# Altium project PCB_Project.PrjPcb
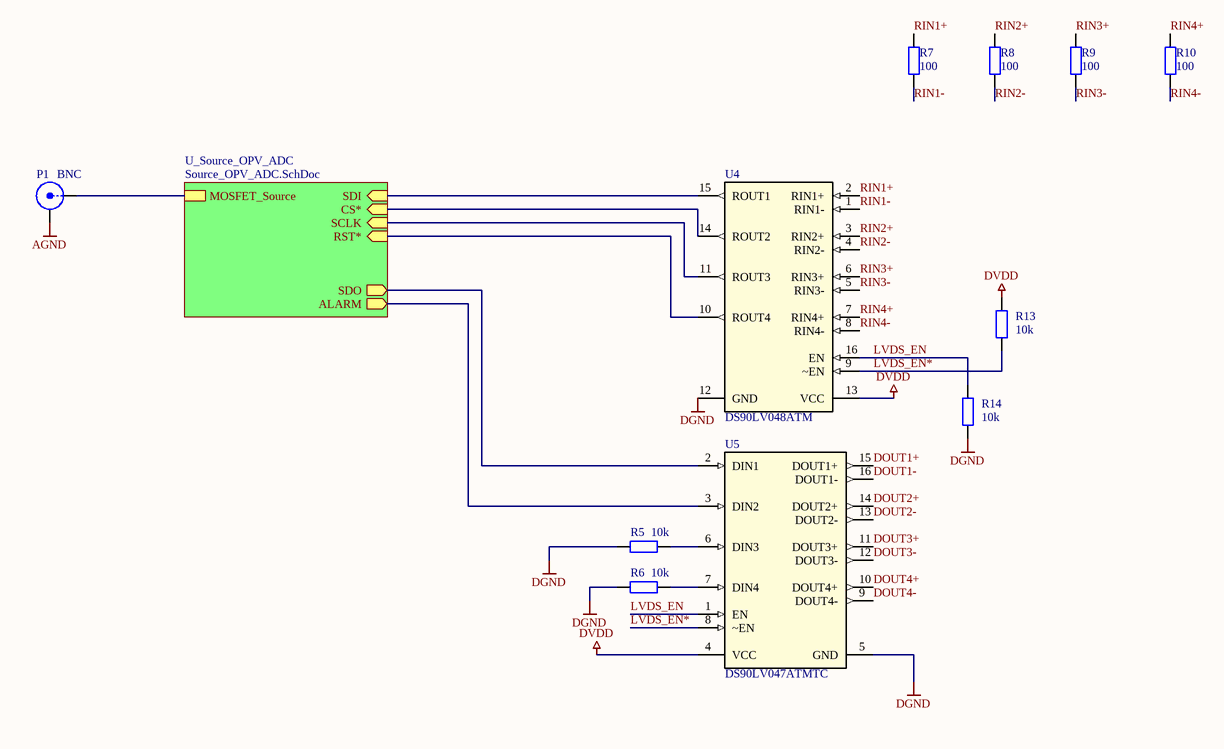
[diagram p0: TOP_Sheet.SchDoc]
3 sheets, 28 parts. Net scope: hierarchical (ports join the sheet entries above them; power ports are global).
Board file: PCB1.PcbDoc
Sheets:
  TOP_Sheet.SchDoc
    U_Source_OPV_ADC = Source_OPV_ADC.SchDoc
  SPI_Diff_Slave.SchDoc

## Sheet TOP_Sheet.SchDoc
size A4; Organization: HTL Hollabrunn; Address1: Abteilung Elektronik; Address2: Anton Ehrenfried-Straße 10; Address3: 2020 Hollabrunn

### Parts
P1  BNC  [BNC_RA CON]
R5  10k  [C1206-KUE]
R6  10k  [C1206-KUE]
R7  100  [C1206-KUE]
R8  100  [C1206-KUE]
R9  100  [C1206-KUE]
R10  100  [C1206-KUE]
R13  10k  [C1206-KUE]
R14  10k  [C1206-KUE]
U4  DS90LV048ATM  [SOIC-16N]
U5  DS90LV047ATMTC  [SOIC-16N]

### Sub-sheets
U_Source_OPV_ADC = Source_OPV_ADC.SchDoc: MOSFET_Source, SDI (in), CS* (in), SCLK (in), SDO (out), ALARM (out), RST* (in)

### Nets
AGND: P1.2(Y)
DGND: R5.2 R6.2 R14.1 U4.12(GND) U5.5(GND)
DVDD: R13.2 U4.13(VCC) U5.4(VCC)
DOUT1+: U5.15(DOUT1+)
DOUT1-: U5.16(DOUT1-)
DOUT2+: U5.14(DOUT2+)
DOUT2-: U5.13(DOUT2-)
DOUT3+: U5.11(DOUT3+)
DOUT3-: U5.12(DOUT3-)
DOUT4+: U5.10(DOUT4+)
DOUT4-: U5.9(DOUT4-)
LVDS_EN: R14.2 U4.16(EN) U5.1(EN)
LVDS_EN*: R13.1 U4.9(~EN) U5.8(~EN)
RIN1+: R7.1 U4.2(RIN1+)
RIN1-: R7.2 U4.1(RIN1-)
RIN2+: R8.1 U4.3(RIN2+)
RIN2-: R8.2 U4.4(RIN2-)
RIN3+: R9.1 U4.6(RIN3+)
RIN3-: R9.2 U4.5(RIN3-)
RIN4+: R10.1 U4.7(RIN4+)
RIN4-: R10.2 U4.8(RIN4-)
NetC1_1: P1.1(X) ; sheet U_Source_OPV_ADC/MOSFET_Source
NetR5_1: R5.1 U5.6(DIN3)
NetR6_1: R6.1 U5.7(DIN4)
NetR12_1: U4.10(ROUT4) ; sheet U_Source_OPV_ADC/RST*
NetU1_10: U4.15(ROUT1) ; sheet U_Source_OPV_ADC/SDI
NetU1_11: U4.14(ROUT2) ; sheet U_Source_OPV_ADC/CS*
NetU1_12: U4.11(ROUT3) ; sheet U_Source_OPV_ADC/SCLK
NetU1_13: U5.2(DIN1) ; sheet U_Source_OPV_ADC/SDO
NetU1_14: U5.3(DIN2) ; sheet U_Source_OPV_ADC/ALARM

### Notes on the sheet
- Title
- Size:
- Date:
- A4
- Number:
- Time:
- Revision:
- Sheet
- of
- HTL Hollabrunn
- Abteilung Elektronik
- Anton Ehrenfried-Straße 10
- 2020 Hollabrunn
- File:
- Drawn By:

### Library data of the parts
P1 = BNC: BNC Elbow Connector; LatestRevisionDate: 17-Jul-2002; LatestRevisionNote: Re-released for DXP Platform.; Publisher: Altium Limited
R5-R10 R13 R14 = ResistorSMD: Resistor SMD; Manufacturer: AVX; Bezeichnung: SMD Wid. 1/8W 2%; Published: 8-Jun-2000; LatestRevisionDate: 17-Jul-2002; LatestRevisionNote: Re-released for DXP Platform.; PackageReference: AXIAL-0.4; Publisher: Altium Limited; PackageDescription: Axial Device, Thru-Hole; 2 Leads; 0.4 in Pin Spacing; Orderingcode: *
  R5 R6 R13 R14: Value: 10k
  R7-R10: Value: 100
U4 = DS90LV048ATM: 400-Mbps LVDS quad high-speed differential receiver 16-SOIC -40 to 85; Manufacturer_Name: Texas Instruments; Manufacturer: NationalSemiconductor; PackageTopMarking: NS2ZXYTTE#DS90LV048ATM; PowerWise: N; CompType: InterfaceIC; ComponentLink1DescBC: DS90LV048ADatasheet; ComponentLink2DescA4: DS90LV048AWebPage; ComponentLink3DescAC: M16APackagePage; Copyright: Copyright (C) 2026 Ultra Librarian. All rights reserved.; Manufacturer_Part_Number: DS90LV048ATM; Datasheet: https://www.ti.com/lit/gpn/ds90lv048a; Published: 4-Dec-2008; DatasheetVersion: May-2001; PackageVersion: revJAug-1995; PackageReference: M16A; Publisher: AltiumLimited; PackageDescription: MoldedPackageSO150inWide16Lead; Supplier: 1Farnell; SUPPLIER_2: PartNumb0C9485856; PartNumber: DS90LV048ATM; RoHS: N; PinCount: 16; Code_JEDEC: MS-012-AC; Code_IPC: SOIC127P600-16; ComponentLink1URL: http//wwwnationalcom/ds/DS/DS90LV048Apdf; ComponentLink2URL: http//wwwnationalcom/pf/DS/DS90LV048Ahtml; ComponentLink3URL: http//wwwnationalcom/packaging/folders/m16ahtml
U5 = DS90LV047ATMTC: 400-Mbps LVDS quad high-speed differential driver 16-TSSOP -40 to 85; Manufacturer_Name: Texas Instruments; Manufacturer: NationalSemiconductor; PackageTopMarking: NS2ZXYTTDS90LV047AT; PowerWise: N; CompType: InterfaceIC; ComponentLink1DescBC: DS90LV047ADatasheet; ComponentLink2DescA4: DS90LV047AWebPage; ComponentLink3DescAC: MTC16PackagePage; Copyright: Copyright (C) 2025 Ultra Librarian. All rights reserved.; Manufacturer_Part_Number: DS90LV047ATMTC; Published: 4-Dec-2008; DatasheetVersion: Jan-2003; PackageVersion: revDJun-2003; PackageReference: MTC16; Publisher: AltiumLimited; PackageDescription: MoldedTSSOPJedec5x44x09mmBody16Lead065mmPitch; Supplier: 1Farnell; SUPPLIER_2: PartNumb0C9778659; PartNumber: DS90LV047ATMTC; RoHS: N; PinCount: 16; Code_JEDEC: MO-153-AB; ComponentLink1URL: http//wwwnationalcom/ds/DS/DS90LV047Apdf; ComponentLink2URL: http//wwwnationalcom/pf/DS/DS90LV047Ahtml; ComponentLink3URL: http//wwwnationalcom/packaging/folders/mtc16html

## Sheet Source_OPV_ADC.SchDoc
size A4; Organization: HTL Hollabrunn; Address1: Abteilung Elektronik; Address2: Anton Ehrenfried-Straße 10; Address3: 2020 Hollabrunn; SheetNumber: 1; SheetTotal: 1; SPICEModelCacheMUVHOLEX: <root> / <DocumentId>MUVHOLEX</DocumentId> / <CacheFrame Number="0"> / <Model Name="ua741" Kind="CKT"> / <Text>*==================================================== / *uA741 / *Sngl GenPurpose OpAmp pkg:DIP8 3,2,7,4,6. pkg:CAN8 3,2,7,4,6. / * Connections: / *             Non-Inverting Input / *             | Inverting Input / *             | | Positive Power Supply / *             | | | Negative Power Supply / *             | | | | Output / *             | | | | | / .SUBCKT UA741 1 2 3 4 5 / C1   11 12 4.664E-12 / C2    6  7 20E-12 / DC    5 53 DX / DE   54  5 DX / DLP  90 91 DX / DLN  92 90 DX / DP    4  3 DX / BGND 99  0 V=V(3)*.5 + V(4)*.5 / BB    7 99 I=I(VB)*10.61E6 - I(VC)*10E6 + I(VE)*10E6 + / +              I(VLP)*10E6 - I(VLN)*10E6 / GA    6  0 11 12 137.7E-6 / GCM   0  6 10 99 2.574E-9 / IEE  10  4 DC 10.16E-6 / HLIM 90  0 VLIM 1K / Q1   11  2 13 QX / Q2   12  1 14 QX / R2    6  9 100E3 / RC1   3 11 7.957E3 / RC2   3 12 7.957E3 / RE1  13 10 2.74E3 / RE2  14 10 2.74E3 / REE  10 99 19.69E6 / RO1   8  5 150 / RO2   7 99 150 / RP    3  4 18.11E3 / VB    9  0 DC 0 / VC    3 53 DC 2.6 / VE   54  4 DC 2.6 / VLIM  7  8 DC 0 / VLP  91  0 DC 25 / VLN   0 92 DC 25 / .MODEL DX D(IS=800E-18) / .MODEL QX NPN(IS=800E-18 BF=62.5) / .ENDS UA741</Text> / </Model> / <Model Name="cap" Kind="MDL"> / <Text>*Default semiconductor capacitor / .MODEL CAP C()</Text> / </Model> / </CacheFrame> / </root>
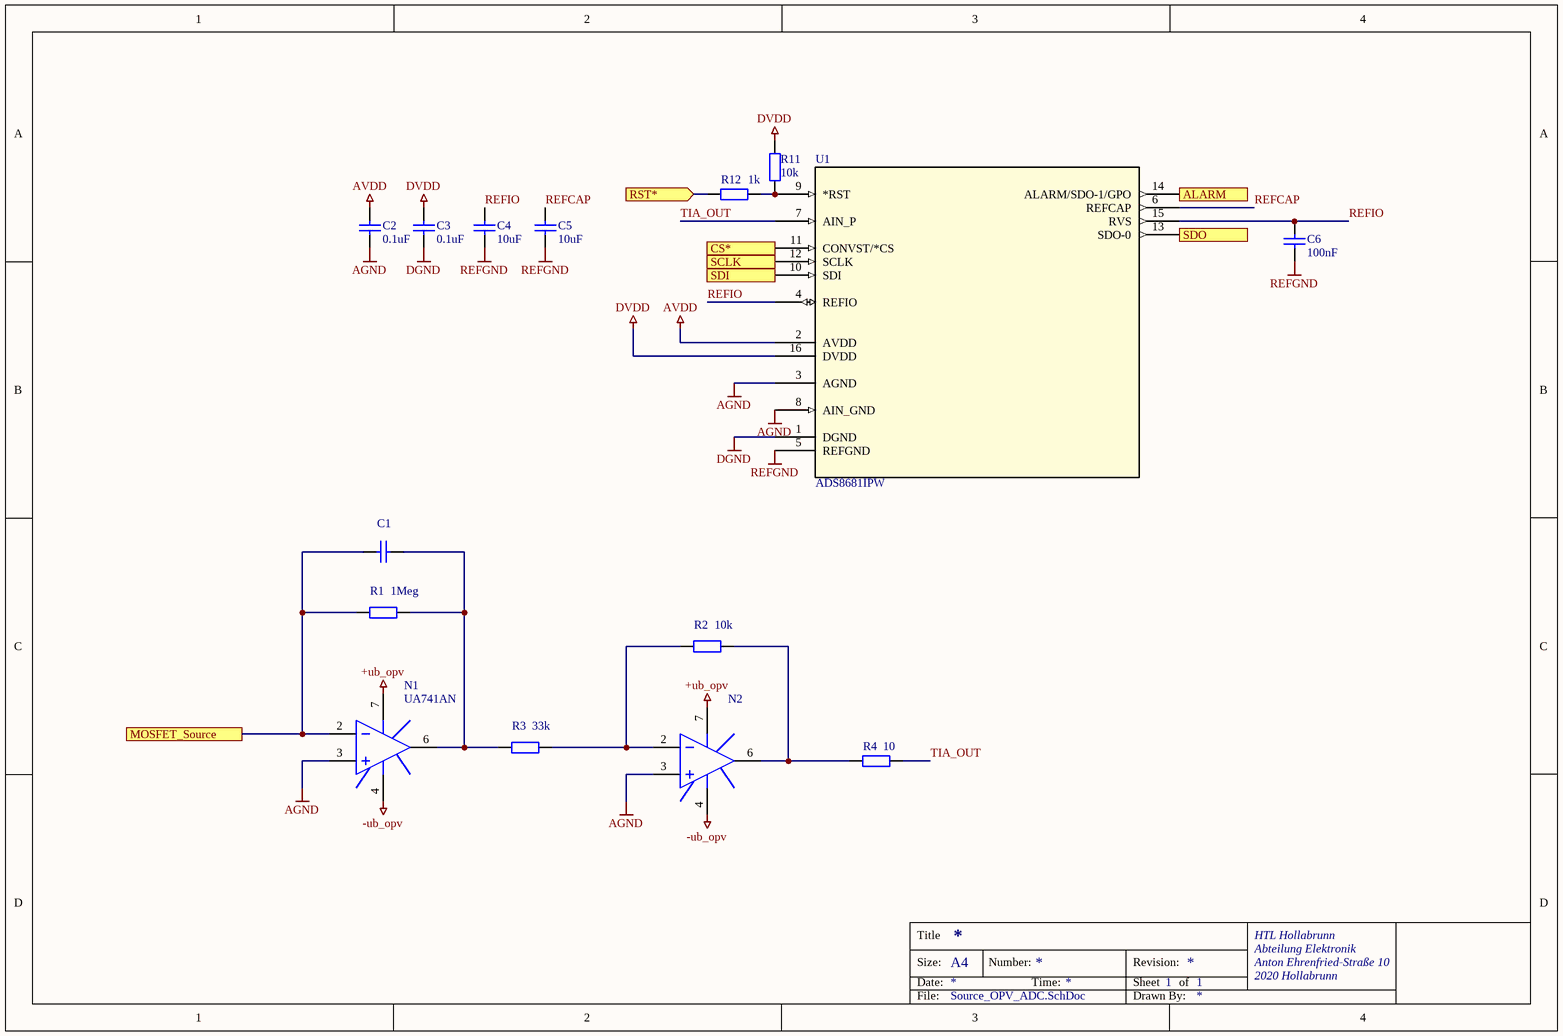
[diagram p1: Source_OPV_ADC.SchDoc]

### Parts
C1  100nF  [C1206-KUE]  (value not drawn)
C2  0.1uF  [C1206-KUE]
C3  0.1uF  [C1206-KUE]
C4  10uF  [C1206-KUE]
C5  10uF  [C1206-KUE]
C6  100nF  [C1206-KUE]
N1  UA741AN  [DIP8]
N2  UA741AN  [DIP8]  (value not drawn)
R1  1Meg  [C1206-KUE]
R2  10k  [C1206-KUE]
R3  33k  [C1206-KUE]
R4  10  [C1206-KUE]
R11  10k  [C1206-KUE]
R12  1k  [C1206-KUE]
U1  ADS8681IPW  [PW16_TEX]

### Ports
ALARM (out), CS* (in), MOSFET_Source, RST* (in), SCLK (in), SDI (in), SDO (out)

### Nets
+ub_opv: N1.7(V+) N2.7(V+)
-ub_opv: N1.4(V-) N2.4(V-)
AGND: C2.1 N1.3(IN+) N2.3(IN+) U1.3(AGND) U1.8(AIN_GND)
AVDD: C2.2 U1.2(AVDD)
DGND: C3.1 U1.1(DGND)
DVDD: C3.2 R11.1 U1.16(DVDD)
REFGND: C4.1 C5.1 C6.1 U1.5(REFGND)
REFCAP: C5.2 U1.6(REFCAP)
REFIO: C4.2 C6.2 U1.4(REFIO) U1.15(RVS)
TIA_OUT: R4.1 U1.7(AIN_P)
NetC1_1: C1.1 N1.2(IN-) R1.2 ; port MOSFET_Source
NetC1_2: C1.2 N1.6(OUT) R1.1 R3.2
NetN2_2: N2.2(IN-) R2.2 R3.1
NetN2_6: N2.6(OUT) R2.1 R4.2
NetR11_2: R11.2 R12.2 U1.9(*RST)
NetR12_1: R12.1 ; port RST*
NetU1_10: U1.10(SDI) ; port SDI
NetU1_11: U1.11(CONVST/*CS) ; port CS*
NetU1_12: U1.12(SCLK) ; port SCLK
NetU1_13: U1.13(SDO-0) ; port SDO
NetU1_14: U1.14(ALARM/SDO-1/GPO) ; port ALARM

Not connected (* = marked no-connect by the designer): N1 1(OS_NULL) 5(OS_NULL) 8(NC); N2 1(OS_NULL) 5(OS_NULL) 8(NC)

### Notes on the sheet
- Title
- Size:
- Date:
- A4
- Number:
- Time:
- Revision:
- Sheet
- of
- HTL Hollabrunn
- Abteilung Elektronik
- Anton Ehrenfried-Straße 10
- 2020 Hollabrunn
- File:
- Drawn By:

### Library data of the parts
C1-C6 = Capacitor: Manufacturer: Kemet; Bezeichnung: Kerko +-10% 63V; Published: 8-Jun-2000; LatestRevisionDate: 17-Jul-2002; LatestRevisionNote: Re-released for DXP Platform.; PackageReference: RAD-0.3; Publisher: Altium Limited; PackageDescription: Radial Cap, Thru-Hole; 2 Leads; 0.3 in Pin Spacing; Orderingcode: *
  C1 C6: Value: 100nF
  C2 C3: Value: 0.1uF
  C4 C5: Value: 10uF
N1 N2 = UA741AN: General-Purpose Single Operational Amplifier; Published: 24-Aug-2001; LatestRevisionDate: 06-Jun-2005; LatestRevisionNote: Stylized 3D Model Added.; DatasheetVersion: Oct-1997; PackageReference: DIP8; Publisher: Altium Limited; PackageDescription: DIP; 8 Leads; Row Spacing 7.62 mm; Pitch 2.54 mm; Code_JEDEC: MO-001-AN; ComponentLink1Description: Manufacturer Link; ComponentLink1URL: http://www.st.com/; ComponentLink2Description: Datasheet; ComponentLink2URL: http://www.st.com/stonline/products/literature/ds/5304/ua741.pdf
R1-R4 R11 R12 = ResistorSMD: as R5 on sheet TOP_Sheet; Published: 8-Jun-2000; LatestRevisionDate: 17-Jul-2002; LatestRevisionNote: Re-released for DXP Platform.; PackageReference: AXIAL-0.4; Publisher: Altium Limited; PackageDescription: Axial Device, Thru-Hole; 2 Leads; 0.4 in Pin Spacing; Orderingcode: *
  R1: Value: 1Meg
  R2 R11: Value: 10k
  R3: Value: 33k
  R4: Value: 10
  R12: Value: 1k
U1 = ADS8681IPW: 16-bit, 1MSPS 1-ch SAR ADC with programmable (Â±12V, Â±10V, Â±6V, Â±5V, Â±2.5V) input ranges on 5V supply 16-TSSOP -40 to 125; Manufacturer_Name: Texas Instruments; Copyright: Copyright (C) 2025 Ultra Librarian. All rights reserved.; Manufacturer_Part_Number: ADS8681IPW; RefDes: RefDes; Type: Type

## Sheet SPI_Diff_Slave.SchDoc
size A4; Organization: HTL Hollabrunn; Address1: Abteilung Elektronik; Address2: Anton Ehrenfried-Straße 10; Address3: 2020 Hollabrunn
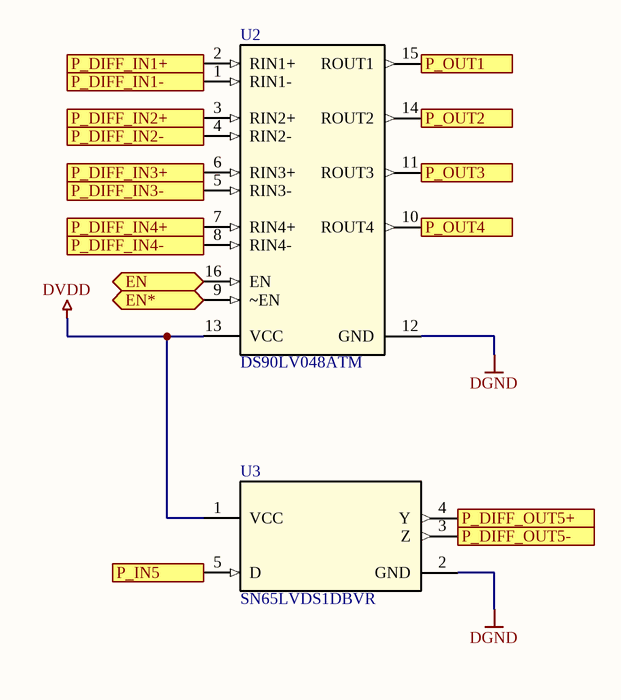
[diagram p2: SPI_Diff_Slave.SchDoc]

### Parts
U2  DS90LV048ATM  [SOIC-16N]
U3  SN65LVDS1DBVR  [DBV5]

### Ports
EN (bidir), EN* (bidir), P_DIFF_IN1+ (in), P_DIFF_IN1- (in), P_DIFF_IN2+ (in), P_DIFF_IN2- (in), P_DIFF_IN3+ (in), P_DIFF_IN3- (in), P_DIFF_IN4+ (in), P_DIFF_IN4- (in), P_DIFF_OUT5+ (out), P_DIFF_OUT5- (out), P_IN5 (in), P_OUT1 (out), P_OUT2 (out), P_OUT3 (out), P_OUT4 (out)

### Nets
DGND: U2.12(GND) U3.2(GND)
DVDD: U2.13(VCC) U3.1(VCC)
NetU2_1: U2.1(RIN1-) ; port P_DIFF_IN1-
NetU2_2: U2.2(RIN1+) ; port P_DIFF_IN1+
NetU2_3: U2.3(RIN2+) ; port P_DIFF_IN2+
NetU2_4: U2.4(RIN2-) ; port P_DIFF_IN2-
NetU2_5: U2.5(RIN3-) ; port P_DIFF_IN3-
NetU2_6: U2.6(RIN3+) ; port P_DIFF_IN3+
NetU2_7: U2.7(RIN4+) ; port P_DIFF_IN4+
NetU2_8: U2.8(RIN4-) ; port P_DIFF_IN4-
NetU2_9: U2.9(~EN) ; port EN*
NetU2_10: U2.10(ROUT4) ; port P_OUT4
NetU2_11: U2.11(ROUT3) ; port P_OUT3
NetU2_14: U2.14(ROUT2) ; port P_OUT2
NetU2_15: U2.15(ROUT1) ; port P_OUT1
NetU2_16: U2.16(EN) ; port EN
NetU3_3: U3.3(Z) ; port P_DIFF_OUT5-
NetU3_4: U3.4(Y) ; port P_DIFF_OUT5+
NetU3_5: U3.5(D) ; port P_IN5

### Notes on the sheet
- Title
- Size:
- Date:
- A4
- Number:
- Time:
- Revision:
- Sheet
- of
- HTL Hollabrunn
- Abteilung Elektronik
- Anton Ehrenfried-Straße 10
- 2020 Hollabrunn
- File:
- Drawn By:

### Library data of the parts
U2 = DS90LV048ATM: as U4 on sheet TOP_Sheet; Copyright: Copyright (C) 2026 Ultra Librarian. All rights reserved.; Manufacturer_Part_Number: DS90LV048ATM; Datasheet: https://www.ti.com/lit/gpn/ds90lv048a; Published: 4-Dec-2008; DatasheetVersion: May-2001; PackageVersion: revJAug-1995; PackageReference: M16A; Publisher: AltiumLimited; PackageDescription: MoldedPackageSO150inWide16Lead; Supplier: 1Farnell; SUPPLIER_2: PartNumb0C9485856; PartNumber: DS90LV048ATM; RoHS: N; PinCount: 16; Code_JEDEC: MS-012-AC; Code_IPC: SOIC127P600-16; ComponentLink1URL: http//wwwnationalcom/ds/DS/DS90LV048Apdf; ComponentLink2URL: http//wwwnationalcom/pf/DS/DS90LV048Ahtml; ComponentLink3URL: http//wwwnationalcom/packaging/folders/m16ahtml
U3 = SN65LVDS1DBVR: 630-Mbps single LVDS driver 5-SOT-23 -40 to 85; Manufacturer_Name: Texas Instruments; Alternate_PartNumber: SN65LVDS1DBVT; CompType: IC; TYPE: TYPE; RefDes: RefDes; Copyright: Copyright (C) 2026 Ultra Librarian. All rights reserved.; Manufacturer_Part_Number: SN65LVDS1DBVR; PartNumber: SN65LVDS1DBVR; PackageReference: DBV0005A; MountType: SMT; RoHS: Y; Manufacturer: Texas Instruments

## Nets that join several sheets
AGND: TOP_Sheet (P1.2), Source_OPV_ADC (5 pins)
DGND: TOP_Sheet (5 pins), Source_OPV_ADC (C3.1 U1.1), SPI_Diff_Slave (U2.12 U3.2)
DVDD: TOP_Sheet (R13.2 U4.13 U5.4), Source_OPV_ADC (C3.2 R11.1 U1.16), SPI_Diff_Slave (U2.13 U3.1)
NetC1_1: TOP_Sheet (P1.1), Source_OPV_ADC (C1.1 N1.2 R1.2)
NetR12_1: TOP_Sheet (U4.10), Source_OPV_ADC (R12.1)
NetU1_10: TOP_Sheet (U4.15), Source_OPV_ADC (U1.10)
NetU1_11: TOP_Sheet (U4.14), Source_OPV_ADC (U1.11)
NetU1_12: TOP_Sheet (U4.11), Source_OPV_ADC (U1.12)
NetU1_13: TOP_Sheet (U5.2), Source_OPV_ADC (U1.13)
NetU1_14: TOP_Sheet (U5.3), Source_OPV_ADC (U1.14)